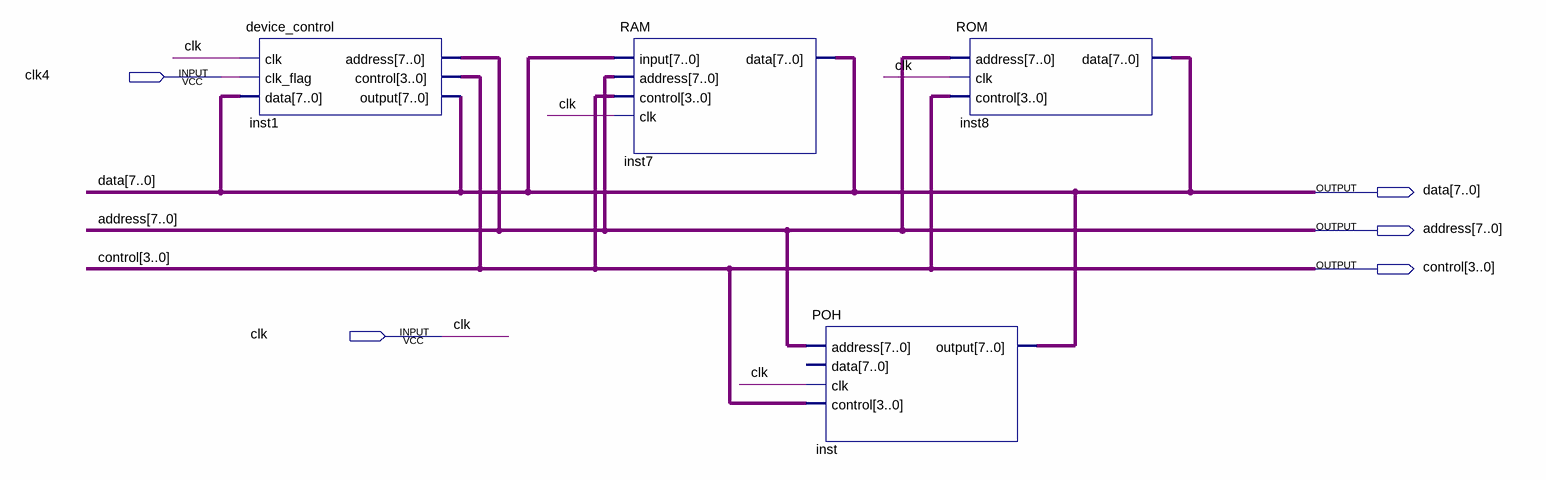
[diagram p0: schematic sheet]
// Quartus schematic main.bdf as structural Verilog: 4 symbols, 5 pins
module main (
  input  clk4,
  input  clk,
  output [7:0] data,
  output [7:0] address,
  output [3:0] control
);

  device_control inst1 (.clk(clk), .clk_flag(clk4), .data(data), .address(address), .control(control), .\output (data));
  RAM inst7 (.\input (data), .address(address), .control(control), .clk(clk), .data(data));
  POH inst (.address(address), .clk(clk), .control(control), .\output (data));  // open: data
  ROM inst8 (.address(address), .clk(clk), .control(control), .data(data));
endmodule
